# EAGLE design TX Board (EAGLE 6.4)
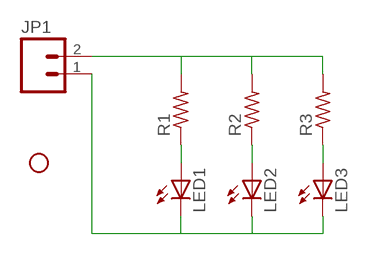
[diagram p0: schematic, sheet 1]

## Parts
JP1  M02PTH4  [1X02_XTRA_BIG]
JP2  STAND-OFF  [STAND-OFF]
LED1  LED-FKIT-1206  [FKIT-LED-1206]
LED2  LED-FKIT-1206  [FKIT-LED-1206]
LED3  LED-FKIT-1206  [FKIT-LED-1206]
R1  R-US_M1206  [M1206]
R2  R-US_M1206  [M1206]
R3  R-US_M1206  [M1206]

## Nets
GND: JP1.2 R1.2 R2.2 R3.2
N$1: LED1.A R1.1
N$2: LED2.A R2.1
N$3: LED3.A R3.1
N$4: JP1.1 LED1.C LED2.C LED3.C

## Library data of the parts
JP1 = SparkFun:M02: Header 2 Standard 2-pin 0.1" header. Use with straight break away headers (SKU : PRT-00116), right angle break away headers (PRT-00553), swiss pins (PRT-00743), machine pins (PRT-00117), and female headers (PRT-00115). Molex polarized connector foot print use with SKU : PRT-08233 with associated crimp pins and housings.
JP2 = SparkFun:STAND-OFF: Stand Off This is the mechanical footprint for a #4 phillips button head screw. Use the keepout ring to avoid running the screw head into surrounding components. SKU : PRT-00447
LED1-LED3 = SparkFun:LED: LEDs Standard schematic elements and footprints for 5mm, 3mm, 1206, and 0603 sized LEDs. 5mm - Spark Fun Electronics SKU : COM-00529 (and others)
R1-R3 = rcl:R-US_: RESISTOR, American symbol

## Board
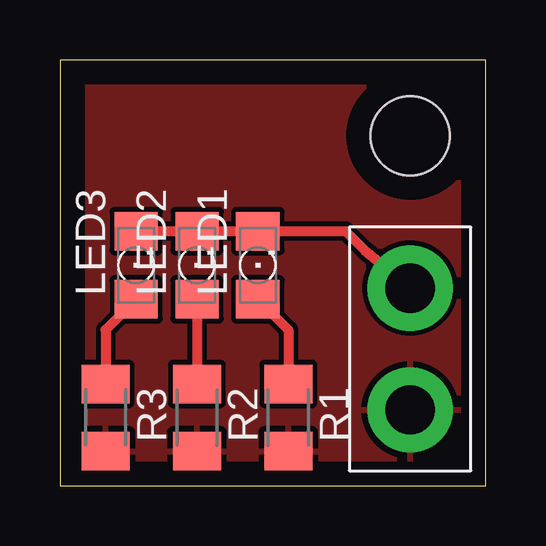
[diagram p1: board, top side]

Size 17.77 x 17.77 mm. Coordinates in mm from the lower left corner, seen from the top.
Outline: 0,0 17.77,0 17.77,17.77 0,17.77 0,0
Copper layers (1*16): Top 0.035mm / dielectric 1.5mm / Bottom 0.035mm
Design rules "default": minimum track width 10mil, minimum drill 24mil, track to track 8mil, track to pad 8mil, pad to pad 8mil, via to via 8mil, smd to smd 8mil, copper to edge 40mil, drill to drill 8mil, minimum pad ring 10mil, minimum via ring 8mil, stop-mask expansion 4mil, vias tented up to drill 0mil, thermal gap 10mil

### Footprints (pad centres in the part's own frame; a part is rotated, then mirrored left to right if it is on the bottom)
1X02_XTRA_BIG = drill 2.057 pad 3.556: 1 -2.54,0; 2 2.54,0
STAND-OFF = hole 3.302: 0,0
FKIT-LED-1206 = smd 1.6 x 1.803: A -1.422,0; C 1.422,0
M1206 = smd 1.6 x 2: 1 -1.4,0; 2 1.4,0

### Placement (x,y rotation side)
JP1  14.61,5.71 270 top
JP2  14.61,14.61 0 top
LED1  8.26,9.21 90 top
LED2  5.71,9.21 90 top
LED3  3.17,9.21 90 top
R1  9.53,2.86 270 top
R2  5.71,2.86 270 top
R3  1.91,2.86 270 top

### Tracks (layer width: path | path; a pad name or v marks a point on that pad's centre or on a via)
GND
  pour Top: 0,17.78 17.78,17.78 17.78,0 0,0
N$1
  Top 0.406: LED1.A 9.53,6.52 R1.1
N$2
  Top 0.406: LED2.A R2.1
N$3
  Top 0.406: LED3.A 1.91,6.52 R3.1
N$4
  Top 0.406: LED3.C LED2.C LED1.C 11.91,10.63 12.7,9.84 JP1.1